# EAGLE schematic radios (EAGLE 9.1.3)

## Sheet 1 of 2
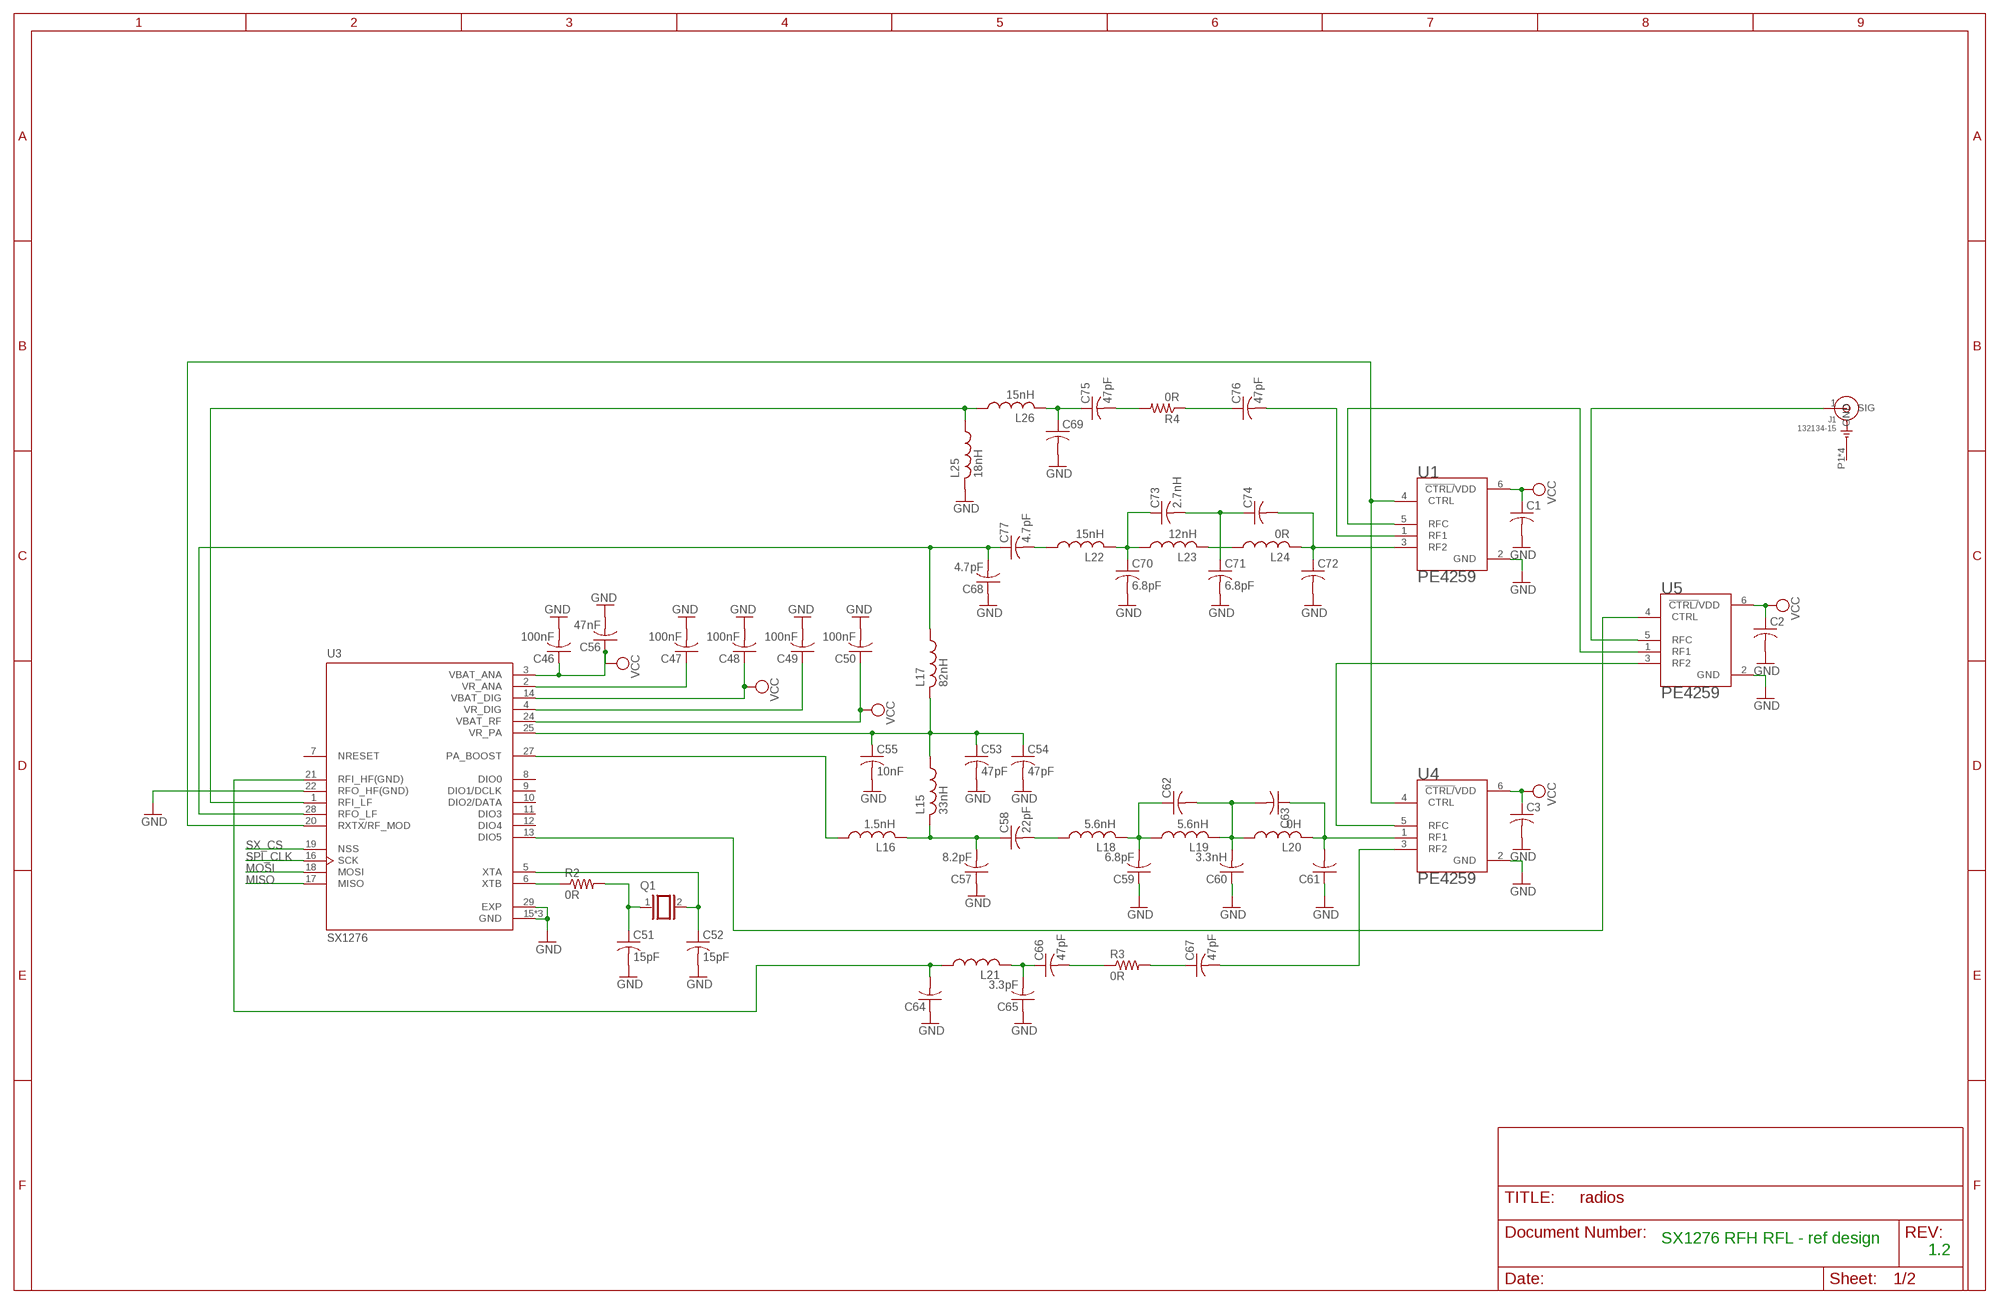
[diagram p0: schematic, sheet 1]

### Parts
C1  C-USC0805  [C0805]
C2  C-USC0805  [C0805]
C3  C-USC0805  [C0805]
C46  100nF  C-USC0805  [C0805]
C47  100nF  C-USC0805  [C0805]
C48  100nF  C-USC0805  [C0805]
C49  100nF  C-USC0805  [C0805]
C50  100nF  C-USC0805  [C0805]
C51  15pF  C-USC0805  [C0805]
C52  15pF  C-USC0805  [C0805]
C53  47pF  C-USC0805  [C0805]
C54  47pF  C-USC0805  [C0805]
C55  10nF  C-USC0805  [C0805]
C56  47nF  C-USC0805  [C0805]
C57  8.2pF  C-USC0805  [C0805]
C58  22pF  C-USC0805  [C0805]
C59  6.8pF  C-USC0805  [C0805]
C60  3.3nH  C-USC0805  [C0805]
C61  C-USC0805  [C0805]
C62  C-USC0805  [C0805]
C63  C-USC0805  [C0805]
C64  C-USC0805  [C0805]
C65  3.3pF  C-USC0805  [C0805]
C66  47pF  C-USC0805  [C0805]
C67  47pF  C-USC0805  [C0805]
C68  4.7pF  C-USC0805  [C0805]
C69  C-USC0805  [C0805]
C70  6.8pF  C-USC0805  [C0805]
C71  6.8pF  C-USC0805  [C0805]
C72  C-USC0805  [C0805]
C73  2.7nH  C-USC0805  [C0805]
C74  C-USC0805  [C0805]
C75  47pF  C-USC0805  [C0805]
C76  47pF  C-USC0805  [C0805]
C77  4.7pF  C-USC0805  [C0805]
J1  132134-15  [AMPHENOL_132134-15]
L15  33nH  L-USL3225M  [L3225M]
L16  1.5nH  L-USL3225M  [L3225M]
L17  82nH  L-USL3225M  [L3225M]
L18  5.6nH  L-USL3225M  [L3225M]
L19  5.6nH  L-USL3225M  [L3225M]
L20  0H  L-USL3225M  [L3225M]
L21  L-USL3225M  [L3225M]
L22  15nH  L-USL3225M  [L3225M]
L23  12nH  L-USL3225M  [L3225M]
L24  0R  L-USL3225M  [L3225M]
L25  18nH  L-USL3225M  [L3225M]
L26  15nH  L-USL3225M  [L3225M]
Q1  XTAL/S  [QS]
R2  0R  R-US_R0805  [R0805]
R3  0R  R-US_R0805  [R0805]
R4  0R  R-US_R0805  [R0805]
U1  PE4259  [SOT65P215X110-6N]
U3  SX1276  [QFN65P600X600X100-29N]
U4  PE4259  [SOT65P215X110-6N]
U5  PE4259  [SOT65P215X110-6N]

### Nets
GND: C1.2 C2.2 C3.2 C46.2 C47.2 C48.2 C49.2 C50.2 C51.2 C52.2 C53.2 C54.2 C55.2 C56.2 C57.1 C59.1 C60.1 C61.1 C64.1 C65.1 C68.1 C69.2 C70.2 C71.2 C72.2 L25.2 U1.2(GND) U3.15(GND) U3.22(RFO_HF(GND)) U3.23(GND) U3.26(GND) U3.29(EXP) U4.2(GND) U5.2(GND) ; also sheet 2
MISO: U3.17(MISO)
MOSI: U3.18(MOSI)
N$1: J1.1(SIG) U5.5(RFC)
N$2: U4.5(RFC) U5.3(RF2)
N$3: U3.13(DIO5) U5.4(CTRL)
N$4: U1.5(RFC) U5.1(RF1)
N$34: R2.1 U3.6(XTB)
N$35: C47.1 U3.2(VR_ANA)
N$36: C51.1 Q1.1 R2.2
N$37: C49.1 U3.4(VR_DIG)
N$38: C52.1 Q1.2 U3.5(XTA)
N$39: C53.1 C54.1 C55.1 L15.1 L17.2 U3.25(VR_PA)
N$40: C68.2 C77.1 L17.1 U3.28(RFO_LF)
N$41: C57.2 C58.1 L15.2 L16.2
N$42: L16.1 U3.27(PA_BOOST)
N$43: C58.2 L18.1
N$44: C59.2 C62.1 L18.2 L19.1
N$45: C60.2 C62.2 C63.2 L19.2 L20.1
N$46: C61.2 C63.1 L20.2 U4.1(RF1)
N$47: C70.1 C73.1 L22.2 L23.1
N$48: C64.2 L21.1 U3.21(RFI_HF(GND))
N$49: C65.2 C66.1 L21.2
N$50: C66.2 R3.1
N$51: C67.1 R3.2
N$52: C67.2 U4.3(RF2)
N$53: C77.2 L22.1
N$54: C71.1 C73.2 C74.1
N$55: L23.2 L24.1
N$56: C72.1 C74.2 L24.2 U1.3(RF2)
N$57: L25.1 L26.1 U3.1(RFI_LF)
N$58: C69.1 C75.1 L26.2
N$59: C75.2 R4.2
N$60: C76.1 R4.1
N$61: C76.2 U1.1(RF1)
N$90: U1.4(CTRL) U3.20(RXTX/RF_MOD) U4.4(CTRL)
SPI_CLK: U3.16(SCK)
SX_CS: U3.19(NSS)
VCC: C1.1 C2.1 C3.1 C46.1 C48.1 C50.1 C56.1 U1.6(!CTRL/!VDD) U3.3(VBAT_ANA) U3.14(VBAT_DIG) U3.24(VBAT_RF) U4.6(!CTRL/!VDD) U5.6(!CTRL/!VDD) ; also sheet 2
Unconnected: J1.P1(GND) J1.P2(GND) J1.P3(GND) J1.P4(GND) U3.7(NRESET) U3.8(DIO0) U3.9(DIO1/DCLK) U3.10(DIO2/DATA) U3.11(DIO3) U3.12(DIO4)

### Notes on the sheet
- SX1276 RFH RFL - ref design
- 1.2

## Sheet 2 of 2
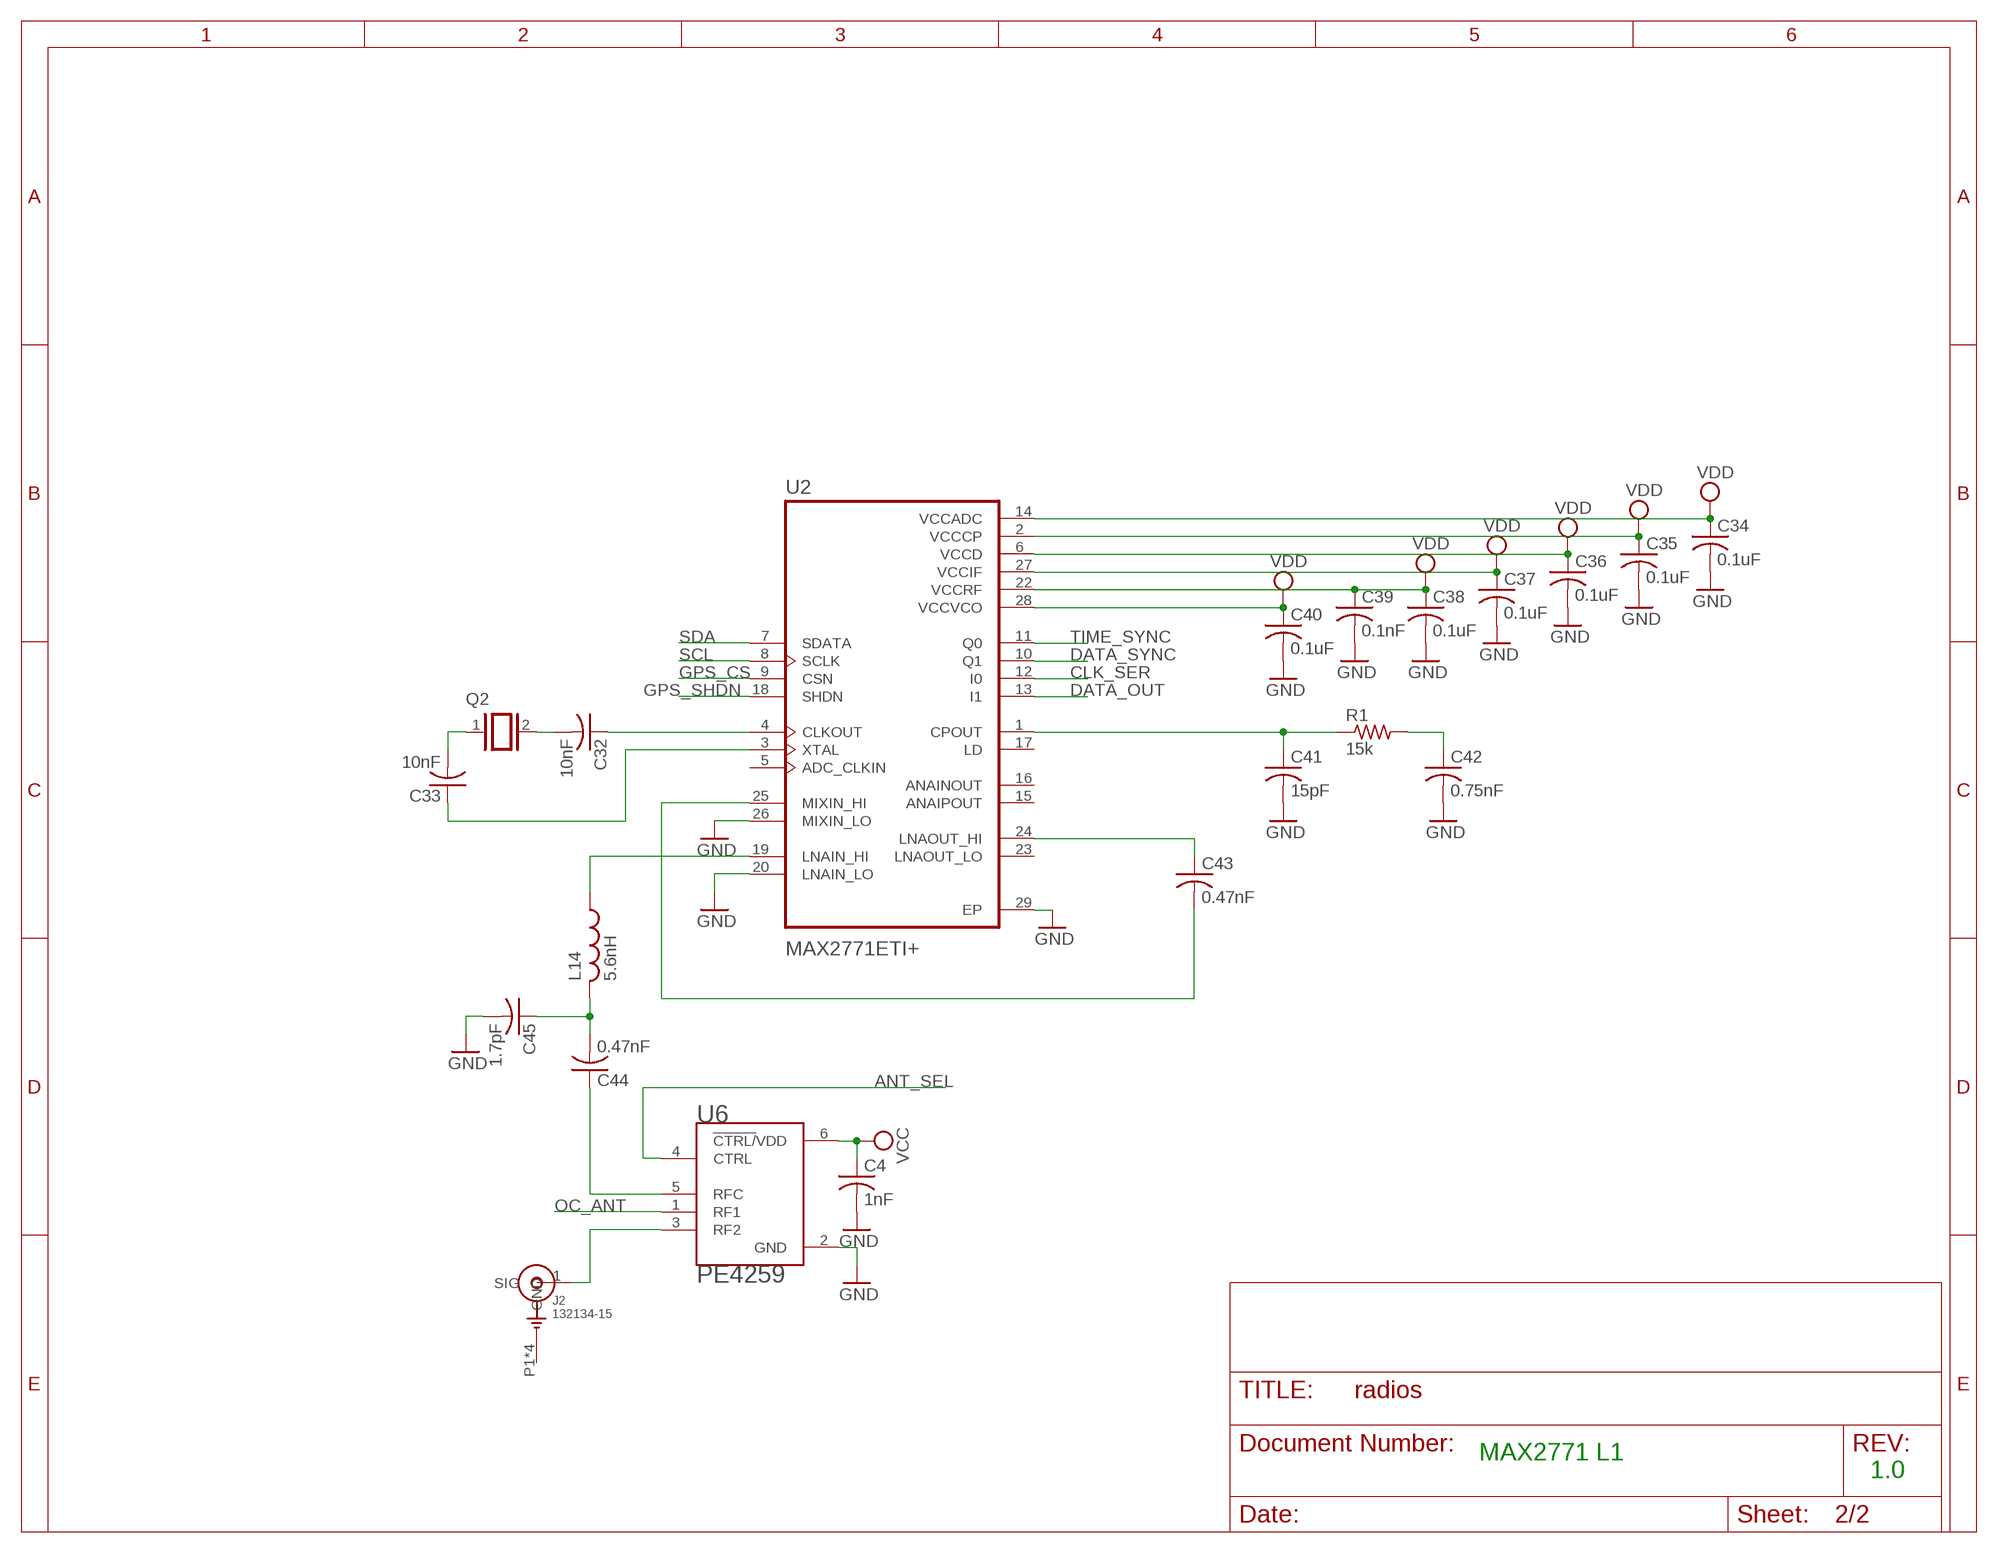
[diagram p1: schematic, sheet 2]

### Parts
C4  1nF  C-USC0805  [C0805]
C32  10nF  C-US050-030X075  [C050-030X075]
C33  10nF  C-US050-030X075  [C050-030X075]
C34  0.1uF  C-US050-030X075  [C050-030X075]
C35  0.1uF  C-US050-030X075  [C050-030X075]
C36  0.1uF  C-US050-030X075  [C050-030X075]
C37  0.1uF  C-US050-030X075  [C050-030X075]
C38  0.1uF  C-US050-030X075  [C050-030X075]
C39  0.1nF  C-US050-030X075  [C050-030X075]
C40  0.1uF  C-US050-030X075  [C050-030X075]
C41  15pF  C-US050-030X075  [C050-030X075]
C42  0.75nF  C-US050-030X075  [C050-030X075]
C43  0.47nF  C-USC0805  [C0805]
C44  0.47nF  C-USC0805  [C0805]
C45  1.7pF  C-USC0805  [C0805]
J2  132134-15  [AMPHENOL_132134-15]
L14  5.6nH  L-USL3225M  [L3225M]
Q2  XTAL/S  [QS]
R1  15k  R-US_R0805  [R0805]
U2  MAX2771ETI+  [QFN50P500X500X80-29N]
U6  PE4259  [SOT65P215X110-6N]

### Nets
ANT_SEL: U6.4(CTRL)
CLK_SER: U2.12(I0)
DATA_OUT: U2.13(I1)
DATA_SYNC: U2.10(Q1)
GND: C4.2 C34.2 C35.2 C36.2 C37.2 C38.2 C39.2 C40.2 C41.2 C42.2 C45.2 U2.20(LNAIN_LO) U2.26(MIXIN_LO) U2.29(EP) U6.2(GND) ; also sheet 1
GPS_CS: U2.9(CSN)
GPS_SHDN: U2.18(SHDN)
N$5: C44.1 U6.5(RFC)
N$6: C33.2 Q2.1
N$7: J2.1(SIG) U6.3(RF2)
N$8: C33.1 U2.3(XTAL)
N$24: C32.2 Q2.2
N$25: C32.1 U2.4(CLKOUT)
N$27: C41.1 R1.1 U2.1(CPOUT)
N$28: C42.1 R1.2
N$29: L14.1 U2.19(LNAIN_HI)
N$30: C43.1 U2.24(LNAOUT_HI)
N$31: C44.2 C45.1 L14.2
N$32: C43.2 U2.25(MIXIN_HI)
OC_ANT: U6.1(RF1)
SCL: U2.8(SCLK)
SDA: U2.7(SDATA)
TIME_SYNC: U2.11(Q0)
VCC: C4.1 U6.6(!CTRL/!VDD) ; also sheet 1
VDD: C34.1 C35.1 C36.1 C37.1 C38.1 C39.1 C40.1 U2.2(VCCCP) U2.6(VCCD) U2.14(VCCADC) U2.22(VCCRF) U2.27(VCCIF) U2.28(VCCVCO)
Unconnected: J2.P1(GND) J2.P2(GND) J2.P3(GND) J2.P4(GND) U2.5(ADC_CLKIN) U2.15(ANAIPOUT) U2.16(ANAINOUT) U2.17(LD) U2.23(LNAOUT_LO)

### Notes on the sheet
- MAX2771 L1
- 1.0

## Library data of the parts
C1-C4 C43-C77 = rcl:C-US: CAPACITOR, American symbol; SPICEPREFIX: C
C32-C42 = rcl:C-US: CAPACITOR, American symbol; SPICEPREFIX: 100nF
J1 J2 = 132134-15:132134-15: Rf Coaxial, Sma, Straight Jack, Pcb; AVAILABILITY: Unavailable; DESCRIPTION: RF Connector SMA Straight PCB Jack Surface Mount 50 Ohm; MF: Amphenol RF; MP: 132134-15; PACKAGE: None; PRICE: None
L14-L26 = rcl:L-US: INDUCTOR, American symbol; SPICEPREFIX: L
Q1 Q2 = special:XTAL/S: CRYSTAL
R1-R4 = rcl:R-US_: RESISTOR, American symbol; SPICEPREFIX: R
U1 U4-U6 = PE4259:PE4259: SPDT High Power UltraCMOS 10 MHz–3.0 GHz RF Switch; AVAILABILITY: Unavailable; MF: pSemi; MP: PE4259; PACKAGE: SOT-363 Peregrine Semiconductor; PRICE: None
U2 = MAX2771ETI_:MAX2771ETI+: None; AVAILABILITY: Unavailable; DESCRIPTION: NEXT-GENERATION GLOBAL NAVIGATIO; MF: Maxim Integrated; MP: MAX2771ETI+; PACKAGE: TQFN-28 Maxim; PRICE: None
U3 = SX1276:SX1276: RF Transceiver FSK/GFSK/MSK/GMSK/LoRa/OOK 137MHz to 1020MHz 28-Pin QFN; AVAILABILITY: Unavailable; DESCRIPTION: RF Transceiver FSK/GFSK/MSK/GMSK/LoRa/OOK 137MHz to 1020MHz 28-Pin QFN; MF: Semtech Corporation; MP: SX1276; PACKAGE: VQFN-28 Semtech Corporation; PRICE: None